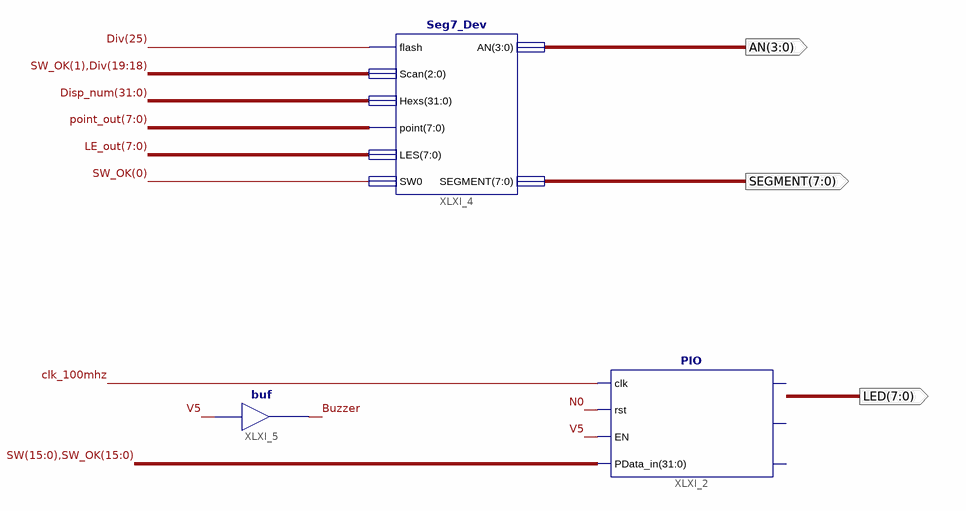
[diagram p0: schematic sheet 1]
// Xilinx ISE schematic Arduino.sch (kintex7) as structural Verilog: 3 symbols, 3 ports
module Arduino (
  output [3:0] AN,
  output [7:0] SEGMENT,
  output [7:0] LED
);

  wire Buzzer, clk_100mhz, N0, V5;
  wire [7:0] LE_out, point_out;
  wire [15:0] SW, SW_OK;
  wire [25:18] Div;
  wire [31:0] Disp_num;

  PIO XLXI_2 (.clk(clk_100mhz), .rst(N0), .EN(V5), .PData_in({SW, SW_OK}));  // open: counter_set, LED_out, GPIOf0
  Seg7_Dev XLXI_4 (
    .flash(Div[25]), .point(point_out), .LES(LE_out), .SW0(SW_OK[0]), .Scan({SW_OK[1], Div[19:18]}),
    .Hexs(Disp_num), .AN(AN), .SEGMENT(SEGMENT));
  buf XLXI_5 (Buzzer, V5);
endmodule
